# EAGLE design GBC USB-C Charging Kit Pro (EAGLE 6.2)
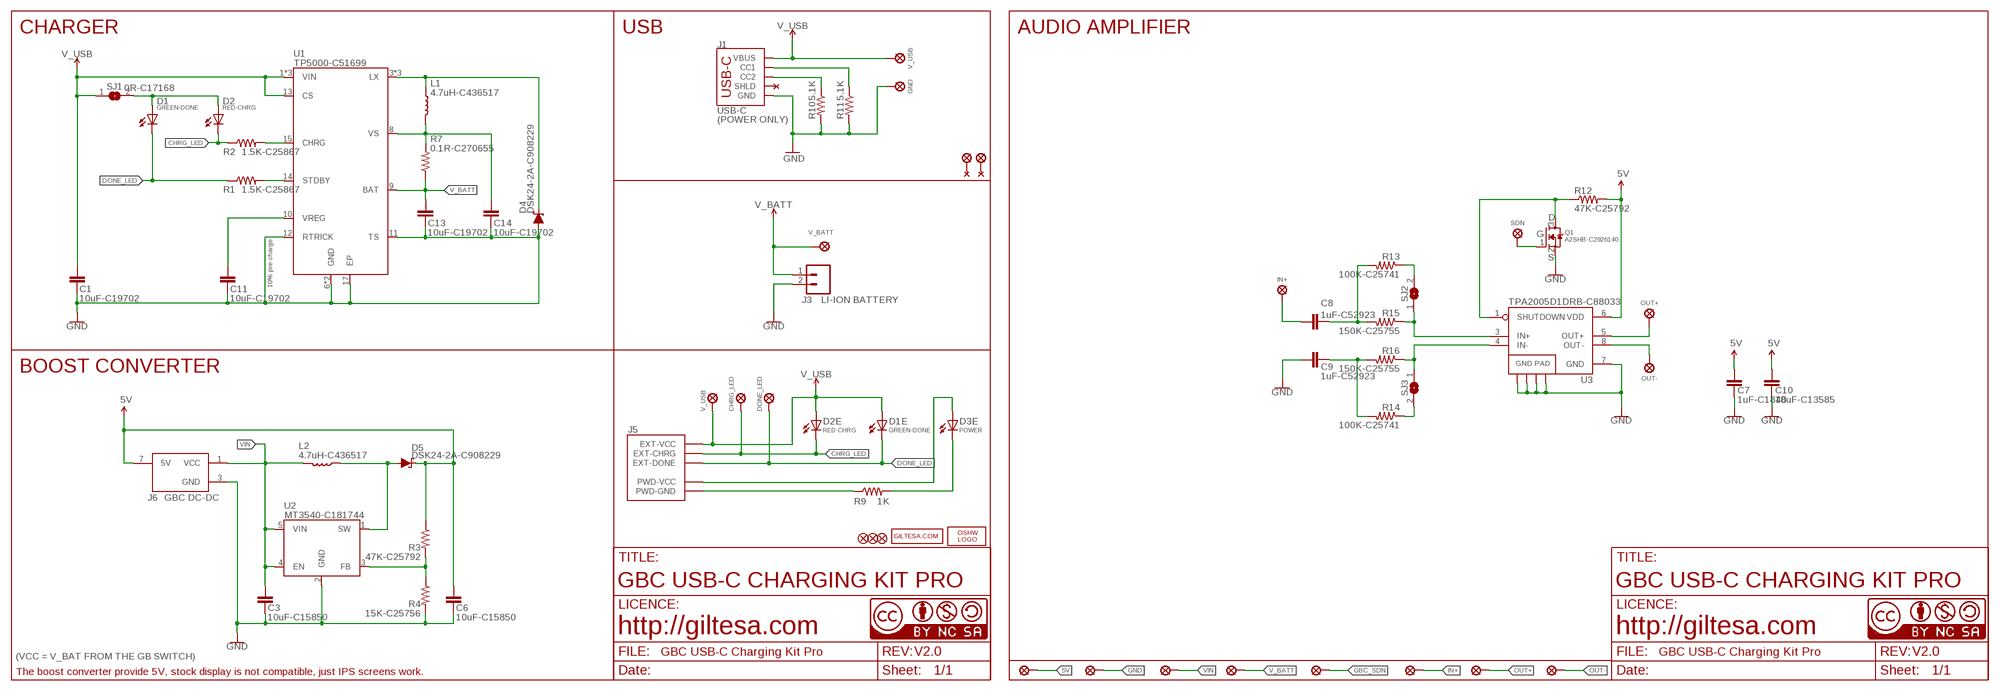
[diagram p0: schematic, sheet 1]

## Parts
C1  10uF-C19702  C0603_SMALL  [C0603_S]
C3  10uF-C15850  C0805_SMALL  [C0805_S]
C6  10uF-C15850  C0805_SMALL  [C0805_S]
C7  1uF-C1848  C1206  [C1206]
C8  1uF-C52923  C0603_SMALL  [C0603_S]
C9  1uF-C52923  C0603_SMALL  [C0603_S]
C10  10uF-C13585  C1206  [C1206]
C11  10uF-C19702  C0603_SMALL  [C0603_S]
C13  10uF-C19702  C0603_SMALL  [C0603_S]
C14  10uF-C19702  C0603_SMALL  [C0603_S]
D1  GREEN-DONE  L0402  [L0402]
D1E  GREEN-DONE  L0402  [L0402]
D2  RED-CHRG  L0402  [L0402]
D2E  RED-CHRG  L0402  [L0402]
D3E  POWER  L0402  [L0402]
D4  DSK24-2A-C908229  DIODE-SCHOTTKY_SOD-123FL  [SOD-123FL]
D5  DSK24-2A-C908229  DIODE-SCHOTTKY_SOD-123FL  [SOD-123FL]
FD2  FIDUCIALUFIDUCIAL  [FIDUCIAL-MICRO]
FD3  FIDUCIALUFIDUCIAL  [FIDUCIAL-MICRO]
FD4  FIDUCIALUFIDUCIAL  [FIDUCIAL-MICRO]
J1  USB-C  USB-CPOWER  [USB-C_6P]
J3  LI-ION BATTERY  JST-21MM  [JST-2-1MM-SMD_RIGHT]
J5  GBC_LED  [GBC_LED]
J6  GBC DC-DC  GBC_DC_DCDIP  [GBC_DC_DC_DIP]
L1  4.7uH-C436517  INDUCTOR_2  [PSPMAA0402]
L2  4.7uH-C436517  INDUCTOR_2  [PSPMAA0402]
LOGO2  OSHW_LOGO_FILLX0150-NT  [OSHW_FILLX150_NOTEXT]
PP1  SOLDER_PAD-1.5  [SOLDER_PAD_1.5]
PP2  SOLDER_PAD-1.5  [SOLDER_PAD_1.5]
PP3  SOLDER_PAD-1.5  [SOLDER_PAD_1.5]
PP4  SOLDER_PAD-1.5  [SOLDER_PAD_1.5]
PP5  SOLDER_PAD-1.5  [SOLDER_PAD_1.5]
PP6  SOLDER_PAD-1.5  [SOLDER_PAD_1.5]
PP7  SOLDER_PAD-1.5  [SOLDER_PAD_1.5]
PP8  SOLDER_PAD-1.5  [SOLDER_PAD_1.5]
Q1  A2SHB-C2926140  MOSFET-NCHANNEL_SMALL  [SOT23-3_S]
R1  1.5K-C25867  R0402  [R0402]
R2  1.5K-C25867  R0402  [R0402]
R3  47K-C25792  R0402  [R0402]
R4  15K-C25756  R0402  [R0402]
R7  0.1R-C270655  R0402  [R0402]
R9  1K  R0402  [R0402]
R10  5.1K  R0402  [R0402]
R11  5.1K  R0402  [R0402]
R12  47K-C25792  R0402  [R0402]
R13  100K-C25741  R0402  [R0402]
R14  100K-C25741  R0402  [R0402]
R15  150K-C25755  R0402  [R0402]
R16  150K-C25755  R0402  [R0402]
SJ1  0R-C17168  JUMPER-SMD0402  [JUMPER-SMD_0402]
SJ2  JUMPER-SMD0402  [JUMPER-SMD_0402]
SJ3  JUMPER-SMD0402  [JUMPER-SMD_0402]
U1  TP5000-C51699  TP5000  [QFN-16_4X4]
U2  MT3540-C181744  MT3540  [SOT-23-5]
U3  TPA2005D1DRB-C88033  TPA2005D1DRB  [QFN-8_PAD]
U$1  V_USB  SOLDER_PAD-1.5  [SOLDER_PAD_1.5]
U$2  SDN  PAD_1.0  [PAD_1.0]
U$3  GND  SOLDER_PAD-1.5  [SOLDER_PAD_1.5]
U$6  CC-BY-NC-SA15MM  [CC-BY-NC-SA_15MM]
U$9  SOLDER_PAD-2.5  [SOLDER_PAD_2.5]
U$16  GILTESA.COM_MASK  [GILTESA.COM_MASK]
U$17  CC-NC-BCNIX  [CC-NC-B_NIX]
U$20  OUT+  SOLDER_PAD-2.0  [SOLDER_PAD_2.0]
U$21  CC-NC-BCNIX  [CC-NC-B_NIX]
U$23  OUT-  SOLDER_PAD-2.0  [SOLDER_PAD_2.0]
U$24  CHRG_LED  SOLDER_PAD-1.3  [SOLDER_PAD_1.3]
U$25  DONE_LED  SOLDER_PAD-1.3  [SOLDER_PAD_1.3]
U$26  V_USB  SOLDER_PAD-1.3  [SOLDER_PAD_1.3]
U$29  V_BATT  PAD_1.25  [PAD_1.25]
U$30  IN+  SOLDER_PAD-1.3  [SOLDER_PAD_1.3]
U$32  SOLDER_PAD-2.5  [SOLDER_PAD_2.5]

## Nets
5V: C6.2 C7.2 C10.2 D5.C J6.7(5V) PP1.P$1 R3.1 R12.2 U3.6(VDD)
CHRG_LED: D2.C D2E.C J5.EXT-CHRG R2.1 U$24.P$1
DONE_LED: D1.C D1E.C J5.EXT-DONE R1.1 U$25.P$1
GBC_SDN: PP5.P$1 Q1.1(G) U$2.P$1
GND: C1.1 C3.1 C6.1 C7.1 C9.2 C10.1 C11.1 C13.1 C14.1 D4.A J1.GND1(GND) J1.GND2(GND) J3.2 J6.3(GND) PP2.P$1 Q1.2(S) R4.2 R10.2 R11.2 U1.6(GND) U1.7(GND) U1.11(TS) U1.12(RTRICK) U1.17(EP) U2.2(GND) U3.7(GND) U3.10(GND) U3.11(GND) U3.12(GND) U3.13(GND) U$3.P$1
IN+: C8.1 PP6.P$1 U$30.P$1
IN+AMP: R15.1 SJ2.1 U3.3(IN+)
IN-AMP: R16.1 SJ3.1 U3.4(IN-)
N$1: D1.A D2.A SJ1.2
N$2: R13.1 SJ2.2
N$3: D5.A L2.P$1 U2.1(SW)
N$4: J1.B5(CC2) R10.1
N$5: R14.1 SJ3.2
N$6: R2.2 U1.15(CHRG)
N$7: R3.2 R4.1 U2.3(FB)
N$8: J5.PWD-GND R9.1
N$10: D3E.A J5.PWD-VCC
N$11: D3E.C R9.2
N$13: J1.A5(CC1) R11.1
N$14: C8.2 R13.2 R15.2
N$15: C9.1 R14.2 R16.2
N$18: C11.2 U1.10(VREG)
N$19: R1.2 U1.14(STDBY)
N$20: C14.2 L1.P$2 R7.2 U1.8(VS)
N$21: D4.C L1.P$1 U1.3(LX) U1.4(LX) U1.5(LX)
OUT+: PP7.P$1 U3.5(OUT+) U$20.P$1
OUT-: PP8.P$1 U3.8(OUT-) U$23.P$1
SDN: Q1.3(D) R12.1 U3.1(SHUTDOWN)
V_BATT: C13.2 J3.1 PP4.P$1 R7.1 U1.9(BAT) U$29.P$1
V_USB: C1.2 D1E.A D2E.A J1.VBUS1(VBUS) J1.VBUS2(VBUS) J5.EXT-VCC SJ1.1 U1.1(VIN) U1.2(VIN) U1.13(CS) U1.16(VIN) U$1.P$1 U$26.P$1
VIN: C3.2 J6.1(VCC) L2.P$2 PP3.P$1 U2.4(EN) U2.5(VIN)
Unconnected: J1.SHLD1(SHLD) J1.SHLD2(SHLD) J1.SHLD3(SHLD) J1.SHLD4(SHLD) J1.SHLD5(SHLD) J1.SHLD6(SHLD) J1.SHLD7(SHLD) J1.SHLD8(SHLD) U$9.P$1 U$32.P$1

## Notes on the sheet
- CHARGER | USB | AUDIO AMPLIFIER
- (POWER ONLY)
- D
- G
- 10% pre-charge
- S
- BOOST CONVERTER
- GBC USB-C CHARGING KIT PRO | GBC USB-C CHARGING KIT PRO
- http://giltesa.com | http://giltesa.com
- (VCC = V_BAT FROM THE GB SWITCH) | V2.0 | V2.0
- The boost converter provide 5V, stock display is not compatible, just IPS screens work.

## Library data of the parts
C1 C8 C9 C11 C13 C14 = ,giltesa:C0603
C3 C6 = ,giltesa:C0805
C7 C10 = ,giltesa:C1206
D1 D1E D2 D2E D3E = ,giltesa:L0402
D4 D5 = ,giltesa:DIODE-SCHOTTKY
FD2-FD4 = SparkFun-Aesthetics:FIDUCIAL: Fiducial Alignment Points Point-of-reference for pick-and-place machines and other optical instruments.
J1 = ,giltesa:USB-C
J3 = ,giltesa:JST-2
J5 = ,giltesa:GBC_LED
J6 = ,giltesa:GBC_DC_DC
L1 L2 = ,giltesa:INDUCTOR
LOGO2 = ohw-logo:OSHW_LOGO_FILL
PP1-PP8 U$1 U$3 U$9 U$20 U$23-U$26 U$30 U$32 = ,giltesa:SOLDER_PAD
Q1 = ,giltesa:MOSFET-NCHANNEL
R1-R4 R7 R9-R16 = ,giltesa:R0402
SJ1-SJ3 = ,giltesa:JUMPER-SMD
U1 = ,giltesa:TP5000
U2 = ,giltesa:MT3540
U3 = mike-temp:TPA2005D1: 1.4W MONO CLASS-D AUDIO POWER AMPLIFIER The TPA2005D1 is a 1.4-W high efficiency filter-free class-D audio power amplifier in a BGA, QFN, or MSOP package that requires only three external components. Datasheet: http://focus.ti.com/lit/ds/symlink/tpa2005d1.pdf 1.4 W Into 8 ? From a 5V Supply at THD = 10% (Typ) Maximum Battery Life and Minimum Heat Efficiency With an 8-? Speaker: 84% at 400 mW, 79% at 100 mW 2.8-mA Quiescent Current 0.5-mA Shutdown Current Ideal for Wireless or Cellular Handsets and PDAs Capable of Driving an 8-? Speaker (2.5 V ? VDD ? 5.5 V) and a 4-? Speaker (2.5 V ? VDD ? 4.2 V) Only Three External Components Optimized PWM Output Stage Eliminates LC Output Filter Internally Generated 250-kHz Switching Frequency Eliminates Capacitor and Resistor Improved PSRR (-71 dB at 217 Hz) and Wide Supply Voltage (2.5 V to 5.5 V) Eliminates Need for a Voltage Regulator Fully Differential Design Reduces RF Rectification and Eliminates Bypass Capacitor Improved CMRR Eliminates Two Input Coupling Capacitors
U$2 U$29 = ,giltesa:PAD
U$6 = ,giltesa_logos:CC-BY-NC-SA
U$16 = ,giltesa_logos:GILTESA.COM
U$17 U$21 = cc-by-nc-sa:CC-NC-BC: All hardware is licensed under the Creative Commons Attribution-Noncommercial-Share Alike 2.5 Switzerland License. To view a copy of this license, visit http://creativecommons.org/licenses/by-nc-sa/2.5/ch/ or send a letter to Creative Commons, 171 Second Street, Suite 300, San Francisco, California, 94105, USA.

## Net classes
1 power: width 0.61 mm, drill 0.406 mm, clearance 0.203 mm
2 gnd: width 0.305 mm, drill 0.406 mm, clearance 0.203 mm
3 power usb: width 0.508 mm, drill 0.406 mm, clearance 0.203 mm

## Board
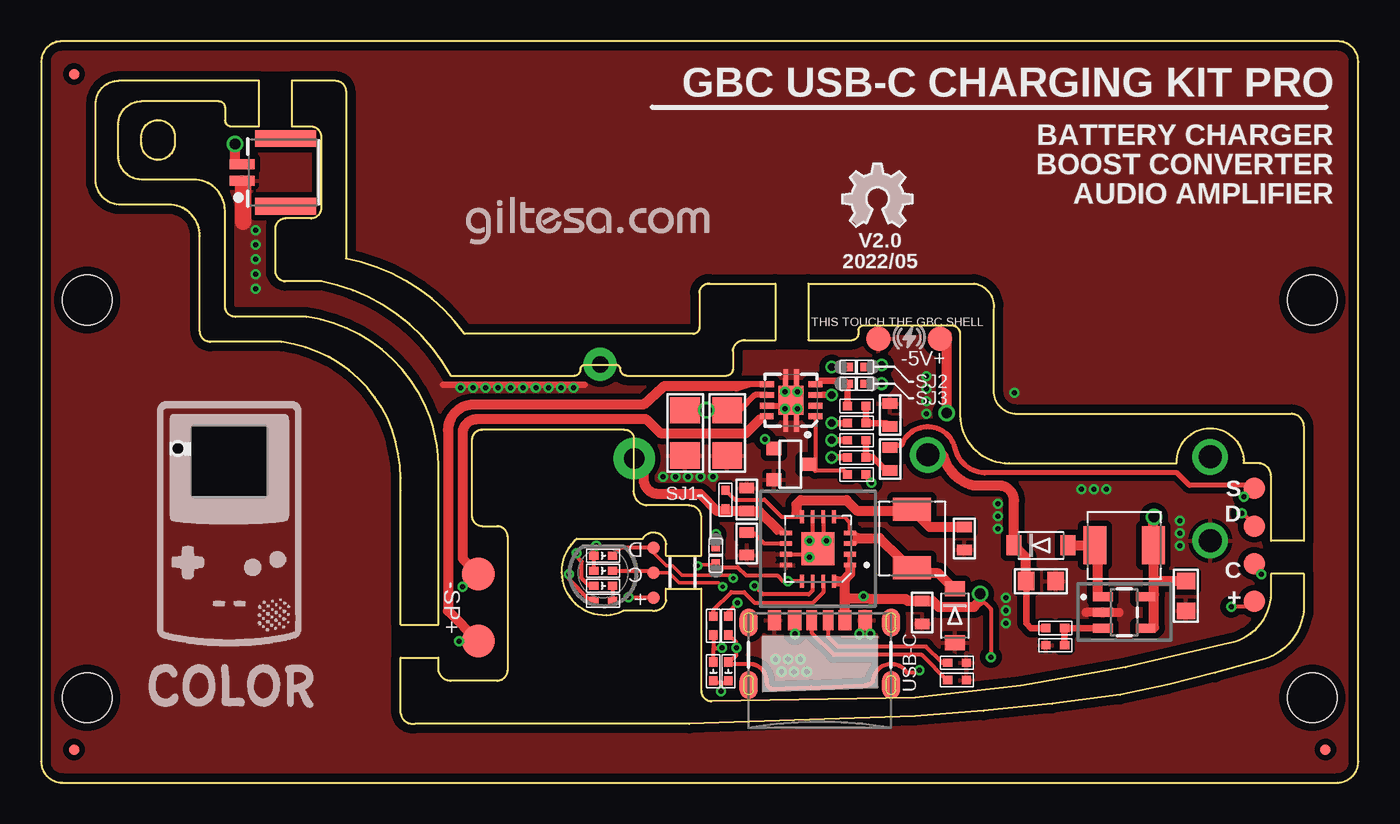
[diagram p1: board, top side]
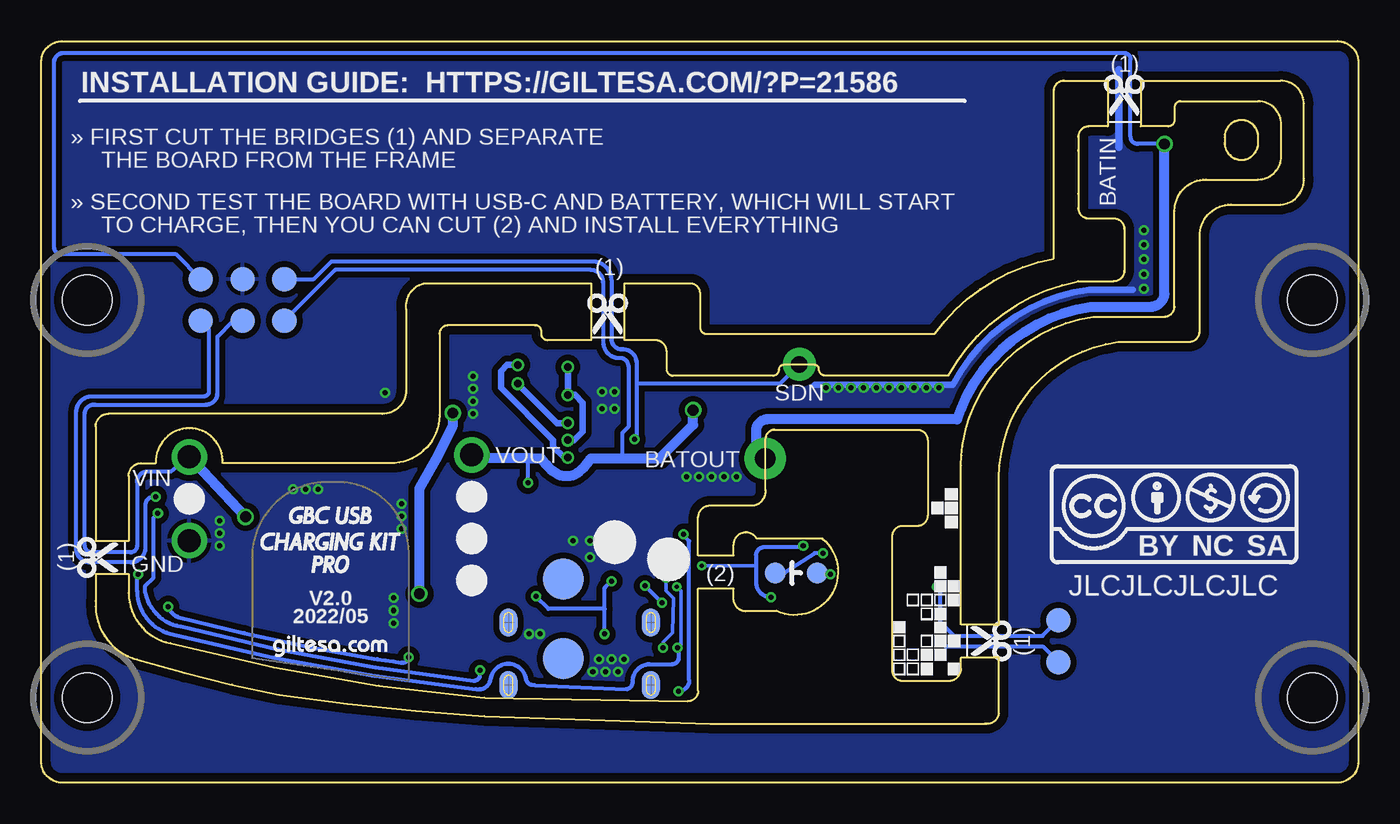
[diagram p2: board, bottom side, seen from below]

Size 79.97 x 45 mm. Coordinates in mm from the lower left corner, seen from the top.
Outline: 17,38.34 17,39.2 arc90 16.37,39.83 15.21,39.83 15.21,42.6 17.87,42.6 arc-90 18.5,41.98 18.5,31.81 arc-44 25.71,27.23 39.58,27.23 arc90 39.97,27.62 39.97,29.75 arc-90 40.6,30.29 44.58,30.29 44.58,26.86 42.76,26.86 arc90 42,26.19 42,25.08 arc-90 41.62,24.7 35.55,24.7 arc-90 35.16,25.1 arc90 34.91,25.35 33.01,25.35 arc90 32.75,25.1 arc-90 32.37,24.7 24.88,24.7 arc50 17,30.43 14.84,30.43 arc-90 14.21,31.07 14.21,33.61 arc-90 14.84,34.24 16.37,34.24 arc90 17,34.88 17,35.74
Outline: 17,38.39 17,35.76
Outline: 40.08,5.58 40.08,11.77 37.93,11.77 37.93,11.09 arc-90 37.13,10.42 35.33,10.42 arc-165 32.53,14.82 36.53,14.82 arc-149 37.93,14.44 37.93,13.77 40.08,13.77 40.08,16.12 arc90 39.31,16.82 36.78,16.82 arc-90 35.98,17.75 35.98,20.91 arc90 35.42,21.42 26.78,21.42 arc90 26.15,20.78 26.15,16.21 arc90 26.78,15.57 27.67,15.57 arc-90 28.31,14.94 28.31,6.81 arc-90 27.67,6.18 24.88,6.18 arc-90 24.11,6.94 24.11,7.59 21.83,7.59 21.83,4.2 arc90 22.69,3.57 39.34,3.57 53.06,4.04 arc5 65.51,5.32 arc5 74.12,7.46 arc80 76.66,11.01 76.66,12.67 74.66,12.67 74.66,11.51 arc-80 72.12,8.46 arc-10 53.06,5.16 40.72,4.94 arc-90 40.08,5.58
Outline: 50,27.75 55.28,27.75 arc-90 55.79,27.24 55.79,22.3 arc90 58.76,19.38 68.95,19.38 arc-185 73.01,19.38 73.9,19.38 arc-90 74.66,18.62 74.66,14.67 76.66,14.67 76.66,21.62 arc90 75.9,22.38 59.24,22.38 arc-90 57.82,23.78 57.82,28.73 arc90 56.65,30.29 46.58,30.29 46.58,26.86 49.24,26.86 arc90 49.62,27.24 49.62,27.46 arc-90 50,27.75
Outline: 1.27,0 78.7,0 arc90 79.97,1.27 79.97,43.73 arc90 78.7,45 1.27,45 arc90 0,43.73 0,1.27 arc90 1.27,0
Outline: 23.61,22.18 arc62 16.11,28.27 11.8,28.27 arc-90 11.16,28.91 11.16,34.7 arc90 9.26,36.6 6.08,36.6 arc-90 4.68,38 4.68,39.96 arc-90 6.08,41.35 10.78,41.35 arc-90 11.16,40.97 11.16,40.21 arc90 11.54,39.83 13.21,39.83 13.21,42.6 4.71,42.6 arc90 3.31,41.2 3.31,36.68 arc90 4.71,35.08 7.73,35.08 arc-90 9.64,33.18 9.64,27.39 arc90 10.27,26.75 14.59,26.75 arc-62 21.32,21.42 arc-20 21.83,17.73 21.83,9.59 24.11,9.59 24.11,19.26 arc20 23.61,22.18
Outline: 6.08,39.2 arc-180 8.11,39.2 8.11,38.81 arc-180 6.08,38.81 6.08,39.2
Copper layers (1*16): Top 0.035mm / dielectric 1.6mm / Bottom 0.035mm
Design rules: minimum track width 6mil, minimum drill 12mil, track to track 6mil, track to pad 6mil, pad to pad 6mil, via to via 8mil, smd to smd 0mil, copper to edge 20mil, drill to drill 10mil, minimum pad ring 6mil, minimum via ring 6mil, stop-mask expansion 0mil, vias tented up to drill 100mil, thermal gap 10mil
Holes 3 mm at 77.17,29.29 2.8,29.29 2.8,5.16 77.17,5.16
tRestrict: area 74.6,12.4 to 74.7,14.9; area 21.6,7.2 to 21.7,9.7; area 76.7,12.4 to 76.9,14.9; area 9.4,17.6 to 13.4,21.4; area 12.9,42.7 to 15.5,42.8; area 44.3,30.4 to 46.8,30.5; area 44.2,26.6 to 46.7,26.8; area 8.4,20.3 to 8.4,20.3; 2 lines
bRestrict: area 74.6,12.4 to 74.7,14.9; area 21.6,7.2 to 21.7,9.7; area 76.7,12.4 to 76.9,14.9; area 44.3,30.4 to 46.8,30.5; area 44.2,26.6 to 46.7,26.8; 1 lines

### Footprints (pad centres in the part's own frame; a part is rotated, then mirrored left to right if it is on the bottom)
C0603_S = smd 0.635 x 0.9: 1 -0.694,0; 2 0.694,0
C0805_S = smd 1 x 1.1: 1 -0.901,0; 2 0.901,0
C1206 = smd 1.6 x 1.8: 1 -1.362,0; 2 1.387,0
L0402 = smd 0.559 x 0.5: A -0.567,0; C 0.567,0
SOD-123FL = smd 0.91 x 1.22: A -1.637,0; C 1.637,0
FIDUCIAL-MICRO = smd 0.635 x 0.635: 1 0,0
USB-C_6P = smd 0.635 x 1.2: A5 -0.5,-0.017; B5 0.5,-0.017 | smd 0.8 x 1.2: GND1 -2.75,-0.017; GND2 2.75,-0.017; VBUS1 -1.52,-0.017; VBUS2 1.52,-0.017 | smd 1.1 x 1.7: SHLD1 -4.32,-0.15; SHLD2 4.32,-0.15; SHLD5 -4.32,-3.95; SHLD8 4.32,-3.95 | smd 1.1 x 1.7 bottom: SHLD3 -4.32,-0.15; SHLD4 4.32,-0.15; SHLD6 -4.32,-3.95; SHLD7 4.32,-3.95
JST-2-1MM-SMD_RIGHT = smd 0.6 x 1.524: 1 -0.5,-2.017; 2 0.5,-2.017 | smd 1.016 x 3.683: NC1 -2.054,0.635; NC2 2.054,0.635
GBC_LED = smd 0.762 x 0.762: EXT-CHRG -3.048,0; EXT-DONE -3.048,-1.524; EXT-VCC -3.048,1.524 | smd 1.27 x 1.27 bottom: PWD-GND 1.27,0; PWD-VCC -1.27,0
GBC_DC_DC_DIP = drill 1.397 pad 2.159: 1 17.145,7.493; 3 17.145,2.413; 7 0,7.62
PSPMAA0402 = smd 1.4 x 2.3: P$1 -1.775,0; P$2 1.775,0
SOLDER_PAD_1.5 = smd 1.5 x 1.5: P$1 0,0
SOT23-3_S = smd 0.8 x 0.9: 1 -0.95,-1; 2 0.95,-1; 3 0,1.1
R0402 = smd 0.559 x 0.5: 1 -0.567,0; 2 0.567,0
JUMPER-SMD_0402 = smd 0.635 x 0.5: 1 -0.559,0; 2 0.559,0
QFN-16_4X4 = smd 0.81 x 0.3: 1 -1.95,0.975; 2 -1.95,0.325; 3 -1.95,-0.325; 4 -1.95,-0.975; 9 1.95,-0.975; 10 1.95,-0.325; 11 1.95,0.325; 12 1.95,0.975 | smd 0.3 x 0.81: 5 -0.975,-1.95; 6 -0.325,-1.95; 7 0.325,-1.95; 8 0.975,-1.95; 13 0.975,1.95; 14 0.325,1.95; 15 -0.325,1.95; 16 -0.975,1.95 | smd 2 x 2: 17 0,0
SOT-23-5 = smd 0.55 x 1.2: 1 -0.95,-1.3; 2 0,-1.3; 3 0.95,-1.3; 4 0.95,1.3; 5 -0.95,1.3
QFN-8_PAD = smd 0.35 x 0.85: 1 -0.975,-1.475; 2 -0.325,-1.475; 3 0.325,-1.475; 4 0.975,-1.475; 5 0.975,1.475; 6 0.325,1.475; 7 -0.325,1.475; 8 -0.975,1.475 | smd 1.75 x 1.5: 9 0,0 | smd 1.025 x 0.28: 10 -1.387,-0.325; 11 1.387,-0.325; 12 1.387,0.325; 13 -1.387,0.325
PAD_1.0 = drill 1 pad 2: P$1 0,0
SOLDER_PAD_2.5 = smd 2.5 x 2.5: P$1 0,0
SOLDER_PAD_2.0 = smd 2 x 2: P$1 0,0
SOLDER_PAD_1.3 = smd 1.3 x 1.3: P$1 0,0
PAD_1.25 = drill 1.25 pad 2.5: P$1 0,0

### Placement (x,y rotation side)
C1  53.49,10.33 90 top
C3  69.51,11.33 90 top
C6  60.71,12.24 180 top
C7  39.09,21.21 90 top
C8  51.54,19.65 270 top
C9  51.54,22.31 90 top
C10  41.65,21.21 90 top
C11  42.84,14.5 90 top
C13  42.84,17.18 270 top
C14  56.05,14.82 90 top
D1  41.72,6.75 90 top
D1E  34.12,13.77 0 top
D2  40.81,6.75 90 top
D2E  34.12,12.86 0 top
D3E  34.12,11.95 0 top
D4  55.48,10.14 90 top
D5  60.71,14.4 180 top
FD2  2,43 0 top
FD3  77.97,2 0 top
FD4  2,2 0 top
J1  47.28,9.87 0 top
J3  14.21,37.04 270 top
J5  34.12,12.73 180 top
J6  53.83,12.27 0 top
L1  52.88,14.82 90 top
L2  65.76,14.4 0 top
LOGO2  48.65,33.75 0 top
PP1  65.2,28.02 0 bottom
PP2  67.75,30.56 0 bottom
PP3  67.75,28.02 0 bottom
PP4  70.28,30.56 0 bottom
PP5  65.2,30.56 0 bottom
PP6  70.28,28.02 0 bottom
PP7  18.21,7.32 0 bottom
PP8  18.21,9.86 0 bottom
Q1  45.48,19.33 270 top
R1  41.72,9.53 90 top
R2  40.81,9.53 90 top
R3  61.57,9.38 0 top
R4  61.57,8.34 180 top
R7  41.55,17.18 90 top
R9  34.12,11.03 0 top
R10  55.61,7.27 0 top
R11  55.61,6.23 0 top
R12  49.52,18.7 0 top
R13  49.52,19.74 0 top
R14  49.52,21.82 0 top
R15  49.52,20.78 0 top
R16  49.52,22.86 0 top
SJ1  40.96,13.79 90 top
SJ2  49.52,25.23 0 top
SJ3  49.52,24.21 0 top
U1  47.16,14.18 180 top
U2  65.76,10.33 270 top
U3  45.53,23.2 90 top
U$1  54.58,26.93 180 top
U$2  33.94,25.38 0 top
U$3  50.83,26.93 180 top
U$6  18.74,13.24 0 bottom
U$7  [GAME_BOY_COLOR_1.2]  6.52,4.55 0 top
U$8  [SCISSOR]  45.57,27.19 90 bottom
U$9  48.27,12.35 0 bottom
U$10  [TETRIS]  24.05,6.43 0 top
U$13  [SCISSOR]  14.2,40.46 90 bottom
U$14  [SCISSOR]  23.55,8.6 0 bottom
U$15  [SCISSOR]  75.29,13.67 180 bottom
U$16  25.7,32.59 0 top
U$17  0,0 0 top
U$19  [QI]  52.7,27.03 180 top
U$20  26.53,8.59 0 top
U$21  0,0 0 top
U$23  26.53,12.65 0 top
U$24  73.64,13.29 0 top
U$25  73.64,15.57 0 top
U$26  73.64,11 0 top
U$28  [GAME_BOY_COLOR_2]  7.02,8.21 0 top
U$29  36.01,19.67 0 top
U$30  73.64,17.86 0 top
U$32  48.27,7.52 0 bottom
U$33  [GILTESA.COM_MASK_7MM]  65.9,7.57 0 bottom
U$34  [GAME_BOY_COLOR_USB_CHARGING_KIT_PRO]  66.66,12.65 0 bottom

### Tracks (layer width: path | path; a pad name or v marks a point on that pad's centre or on a via)
5V  (via drill 0.3, 0.66)
  Top 0.254: R12.2 50.08,18.53 v50.42,18.19
  Top 0.356: U3.6 43.34,23.53 42.42,22.61 41.53,22.61 C10.2
  Top 0.406: R3.1 60.09,9.38 59.8,9.66 C6.2
  Top 0.61: C6.2 59.77,12.24 59.77,13.69 D5.C 59.07,17.13 arc90 59.05,17.14 arc90 58.17,18.03 56.59,18.03 arc-60 54.74,19.89 J6.7 | C7.2 40.38,22.6 v40.39,22.61 41.53,22.61
  Bottom 0.254: 65.01,28.08 65.01,28.02 PP1.P$1 62.11,31.11 46.61,31.11 arc90 45.85,30.35 45.85,26.67 arc-90 44.83,25.78 arc90 44.32,25.27 44.32,21.59 44.7,21.21 44.7,19.68 | v50.42,18.19 50.42,19.77 50.29,19.68
  Bottom 0.61: v40.39,22.61 40.39,21.72 42.42,19.68 44.7,19.68 46.61,19.68 arc30 47.62,18.67 arc30 48.51,18.67 arc30 49.61,19.68 50.29,19.68 53.63,19.68 J6.7
CHRG_LED  (via drill 0.25, 0.3)
  Top 0.203: v41.39,11.89 41.13,12.14 38.72,12.14 38.13,12.73 J5.EXT-CHRG 37.24,12.73
  Top 0.254: D2.C 40.83,8.16 | 40.83,8.16 41.3,8.16 v41.32,8.18 | D2E.C 37.04,12.86 J5.EXT-CHRG | U$24.P$1 v74.09,12.65 | R2.1 40.83,8.16
  Bottom 0.203: v41.39,11.89 41.13,11.64 41.13,8.37 v41.32,8.18
  Bottom 0.254: v74.09,12.65 74.15,12.59 74.15,11.64 arc-80 71.87,8.97 arc-8 53.58,5.67 53.33,5.67 arc-80 52.69,6.3 arc160 50.53,6.3 arc-80 50.15,5.92 50.02,5.92 44.44,5.67 arc-85 44.05,6.18 arc87 43.04,7.19 41.64,7.19 arc-90 41.26,7.57 41.26,8.12 v41.32,8.18
DONE_LED  (via drill 0.25, 0.3)
  Top 0.203: v42.02,12.4 41.84,12.58 38.92,12.58 38.34,13.16 37.96,13.16 37.17,13.95 J5.EXT-DONE
  Top 0.254: J5.EXT-DONE 35.18,14.26 D1E.C | 73.64,15.45 U$25.P$1 73.64,15.7 v72.88,16.34 | v53.33,6.81 53.2,6.68 52.56,6.68 arc138 50.53,6.3 arc-90 50.02,5.92 46.72,5.77 44.44,5.67 arc-90 44.05,6.18 arc88 43.04,7.19 41.83,7.19 D1.C 42.21,7.73 v42.21,8.18 42.21,8.53 R1.1
  Bottom 0.203: v42.21,8.18 42.21,8.53 41.64,9.1 41.58,11.19 42.02,11.64 v42.02,12.4
  Bottom 0.254: 53.33,6.68 v53.33,6.81 53.33,6.56 arc90 53.71,6.18 arc8 71.49,9.48 arc70 73.64,11.51 73.64,11.95 73.15,12.45 73.15,16.07 v72.88,16.34
GBC_SDN  (via drill 0.3)
  Top 0.254: Q1.1 v43.94,20.83
  Bottom 0.254: U$2.P$1 35.11,24.21 43.73,24.21 43.81,24.13 | PP5.P$1 63.42,30.56 62.36,31.62 46.48,31.62 arc90 45.34,30.48 45.34,26.92 arc-90 44.7,26.29 arc90 43.81,25.53 43.81,24.13 | 43.81,24.13 43.81,20.95 v43.94,20.83
GND  (via drill 0.3)
  Top 0.254: v45.15,23.71 45.15,24.54 U3.12 | U3.13 45.2,22.64 v45.15,22.7 | U1.11 46.84,13.86 | U1.6 47.49,14.73 | 47.49,14.73 47.49,14.61 | v47.67,14.69 47.53,14.69 47.49,14.73 | U1.7 46.84,14.51 U1.17
  Top 0.356: U3.7 44.97,22.88 v45.15,22.7
  Top 0.406: 24.39,24.13 32.98,24.13 | 46.84,13.86 47.49,13.86 47.49,14.51 | 47.49,14.51 47.49,14.61 | 47.49,14.51 47.16,14.51 U1.17
  Top 0.559: 63.45,10.33 U2.2 65.45,10.33
  Top 1.016: 12.25,34.04 12.25,36.22
  Bottom 0.406: 32.98,24.13 24.62,24.13 arc55 16.32,29.93 13.7,29.93
  Bottom 0.457: 14.54,43.26 14.54,38.56
  other vias: 25.46,23.96 26.22,23.96 26.99,23.96 27.75,23.96 28.51,23.96 29.27,23.96 30.03,23.96 30.8,23.96 31.56,23.96 32.32,23.96 13.02,33.53 13.02,32.64 13.02,31.75 13.02,30.86 13.02,29.98 45.91,22.7 45.91,23.71 44.57,7.5 45.34,7.5 46.1,7.5 59.09,23.65 44.96,6.73 45.72,6.73 46.48,6.73 49.69,9.02 50.35,9.02 46.66,14.69 46.66,13.67 53.76,24.67 53.76,23.91 53.76,23.15 53.76,22.38 37.76,18.57 38.52,18.57 39.28,18.57 40.04,18.57 40.8,18.57 58.08,16.92 58.08,16.16 58.08,15.4 63.16,17.81 63.92,17.81 64.68,17.81 58.58,11.21 58.58,10.45 58.58,9.68 69.12,15.91 69.12,15.14 69.12,14.38
  pour Top (isolate 0.356): -2,47 81.97,47 81.97,-2 -2,-2
  pour Bottom (isolate 0.356): -2,47 81.97,47 81.97,-2 -2,-2
IN+  (via drill 0.3)
  Top 0.254: v73.01,17.35 73.52,17.86 U$30.P$1 73.34,18.16 | 51.69,20.45 51.58,20.34 C8.1
  Top 0.305: 73.34,18.16 73.34,18.1 73.41,18.03 69.72,18.03 68.96,18.8 57.28,18.8 arc-75 55.49,20.32 arc146 52.22,20.45 51.54,20.45 C8.1
  Top 0.406: 73.64,17.99 U$30.P$1
  Bottom 0.254: v73.01,17.35 73.14,17.35 arc-90 73.64,16.84 73.64,14.26 arc90 74.53,13.37 76.95,13.37 arc90 77.84,14.13 77.84,22.56 arc90 76.82,23.45 70.09,23.45 arc-90 69.78,23.76 69.78,27.51 PP6.P$1
IN+AMP  (via drill 0.46)
  Top 0.305: U3.3 47.46,23.53
  Top 0.381: 47.46,23.53 v47.99,23.53
  Top 0.406: R15.1 v47.99,20.78 | SJ2.1 v47.99,25.23
  Bottom 0.406: v47.99,25.23 v47.99,23.53 47.56,23.53 47.1,23.07 47.1,21.29 47.61,20.78 v47.99,20.78
IN-AMP
  Top 0.305: 47.21,24.38 U3.4
  Top 0.381: 48.95,24.22 SJ3.1 | R16.1 48.96,22.81
  Top 0.406: 48.96,22.81 SJ3.1 | 48.95,24.22 48.93,24.22 48.77,24.38 47.21,24.38
N$1  (via drill 0.3)
  Top 0.254: 41.28,6.07 v41.28,5.55 | SJ1.2 v40.96,15.07 | 41.28,6.07 41.72,6.07 D1.A | 41.28,6.07 40.83,6.07 D2.A
  Bottom 0.254: v41.28,5.55 arc-90 40.62,6.2 40.62,14.66 v40.96,15.07
N$2  (via drill 0.46)
  Top 0.406: R13.1 v47.99,19.74 | SJ2.2 50.91,25.23 v51.04,25.35
  Bottom 0.406: v51.04,25.35 51.67,25.35 52.05,24.97 52.05,23.96 48.88,20.78 48.88,20.4 48.22,19.74 v47.99,19.74
N$3
  Top 0.508: U2.1 64.28,11.28 64.16,11.43
  Top 0.61: D5.A L2.P$1 64.16,14.24 64.16,11.43
N$4
  Top 0.254: J1.B5 47.78,8.87 48.39,8.26 53.72,8.26 54.71,7.27 R10.1
N$5  (via drill 0.46)
  Top 0.406: R14.1 v47.99,21.82 | SJ3.2 v51.04,24.21
  Bottom 0.406: v47.99,21.82 48.65,21.82 v51.04,24.21
N$6
  Top 0.254: 47.5,11.97 U1.15 47.49,11.55 46.86,10.92 43.31,10.92 42.67,11.56 41.91,11.56 40.83,10.48 R2.2
N$7
  Top 0.406: U2.3 R3.2 R4.1
N$8  (via drill 0.3)
  Top 0.254: R9.1 33.31,11.08 32.05,12.34 v32.05,12.65
  Bottom 0.254: J5.PWD-GND 32.07,12.73 v32.05,12.65
N$10  (via drill 0.3)
  Top 0.254: D3E.A 33.24,11.97 32.81,12.4 32.81,13.41 32.5,13.73 v32.5,13.92
  Bottom 0.254: v32.5,13.92 33.01,13.92 34.83,12.73 J5.PWD-VCC
N$11
  Top 0.254: D3E.C R9.2
N$13
  Top 0.254: J1.A5 46.78,9.1 48.13,7.75 53.47,7.75 54.99,6.23 R11.1
N$14
  Top 0.406: R15.2 R13.2 50.49,19.74 51.28,18.95 C8.2
N$15
  Top 0.254: 51.33,21.82 C9.1
  Top 0.381: R14.2 51.33,21.82
  Top 0.406: R16.2 R14.2
N$18
  Top 0.254: U1.10 43.91,14.51 43.23,15.19 C11.2
N$19  (via drill 0.3)
  Top 0.254: U1.14 46.84,11.66 46.61,11.43 43.81,11.43 v43.31,11.94 | R1.2 41.72,10.35 v42.29,10.92
  Bottom 0.254: v43.31,11.94 v42.29,10.92
N$20
  Top 0.254: 41.56,17.75 R7.2 42.11,17.18 43.91,17.18 44.96,16.13 U1.8 45.99,16.33 45.85,16.33
  Top 0.61: 45.85,16.33 45.85,16.89 46.1,17.14 48.9,17.14 49.53,16.51 52.8,16.51 L1.P$2 53.96,15.51 C14.2
N$21
  Top 0.254: U1.3 49.41,14.51 49.73,14.83 49.41,15.16 U1.4 49.11,15.78 48.77,16.13 U1.5 | 49.38,14.68 49.38,15.09 49.58,14.88 49.58,14.83 49.38,14.68 | 49.38,14.53 49.38,14.68
  Top 0.305: 49.73,14.83 49.58,14.83
  Top 0.61: 49.58,14.83 50.91,14.83 52.2,13.55 52.2,13.08 52.24,13.04 L1.P$1 53.22,12.7 54.48,12.7 55.23,11.96 D4.C
OUT+  (via drill 0.3)
  Top 0.152: 42.22,24.05 42.16,23.85 42.24,23.82 43.1,24.08 42.44,23.98
  Top 0.254: v25.39,8.59 U$20.P$1
  Top 0.356: U3.5 42.24,24.18 42.22,24.05
  Top 0.61: U$20.P$1 24.7,10.42 24.7,21.42 arc-90 26.27,22.94 36.56,22.94 37.7,23.96 37.8,24.05 42.22,24.05
  Bottom 0.254: 18.21,7.39 PP7.P$1 19.17,8.27 25.07,8.27 v25.39,8.59
OUT-  (via drill 0.3)
  Top 0.254: v25.58,11.89 26.4,12.65 U$23.P$1
  Top 0.305: 43.62,22.04 43.88,22.23 U3.8
  Top 0.61: U$23.P$1 25.59,13.6 25.59,21.16 arc-90 26.4,22.05 36.75,22.05 37.59,21.21 42.8,21.21 43.62,22.04
  Bottom 0.254: 18.21,9.54 PP8.P$1 19.17,8.9 24.56,8.9 25.39,9.73 25.39,11.64 v25.58,11.89
SDN
  Top 0.254: R12.1 48.95,18.74 48.77,18.92 46.99,18.92 | 46.99,18.92 Q1.3 | U3.1 47.01,18.94 46.99,18.92
V_BATT  (via drill 0.66)
  Top 0.254: U1.9 44.66,15.16 44.58,15.24 44.7,15.37 | 44.7,15.37 44.83,15.49 45.09,15.24 44.83,15.24 44.7,15.37
  Top 0.305: 41.05,16.48 41.42,16.48 R7.1
  Top 0.61: J3.1 11.73,37.54 11.77,37.6 v11.77,38.76 | U$29.P$1 36.08,19.67 36.58,19.18 36.58,18.41 arc90 37.47,17.53 40.01,17.53 41.05,16.48 C13.2 43.59,16.48 44.7,15.37
  Bottom 0.254: v11.77,38.76 13.39,38.76 arc90 13.83,39.2 13.83,43.9 arc-90 14.21,44.28 78.62,44.28 arc-90 79.2,43.7 79.2,32.53 arc-90 78.75,32.08 71.81,32.08 PP4.P$1
  Bottom 0.61: v11.77,38.76 11.77,29.67 arc90 12.69,28.88 16.24,28.88 arc-60 24.11,22.69 24.37,22.05 35.93,22.05 arc-80 36.56,21.42 36.56,20.23 U$29.P$1
V_USB  (via drill 0.25, 0.3, 0.66)
  Top 0.203: SJ1.1 39.94,13.23 v39.86,13.16
  Top 0.254: J5.EXT-VCC 35.72,11.21 v35.67,11.26 | D2E.A D1E.A 33.56,14.22 v33.7,14.37 | U1.16 48.3,12.23 | U1.1 49.11,12.99 | U1.13 v45.34,12.23 45.05,12.23 44.7,12.57 42.8,12.57 42.29,13.08 41.15,13.08 41.02,13.21 40.99,13.21 SJ1.1 | J1.VBUS1 v45.76,9.02 | v49.91,11.3 50.29,11.15 | U$26.P$1 73.61,11 73.28,10.67 v72.26,10.67 | v57.01,11.46 57.01,11.19 57.66,10.54 v57.66,7.62
  Top 0.305: U1.1 U1.2
  Top 0.61: U$1.P$1 54.98,27.18 v54.98,22.43 | 48.3,12.23 48.68,12.23 | 48.68,12.23 49.11,12.66 49.11,12.99 | J1.VBUS2 48.8,11.05 | 48.8,11.05 48.8,12.12 48.68,12.23 | 48.8,11.05 48.83,11.15 50.29,11.15 52.48,11.15 52.61,11.02 C1.2 54.13,11.02 54.48,10.67 56.64,10.67 57.01,11.03 v57.01,11.46
  Bottom 0.203: v39.86,13.16 36.56,13.16
  Bottom 0.254: 45.76,10.54 49.18,10.54 49.91,11.28 v49.91,11.3 | v45.76,9.02 45.76,10.54 | 45.76,10.54 45.76,11.81 v45.34,12.23 | v72.26,10.67 arc-50 71.63,10.03 arc-5 59.56,7.49 arc0 58.12,7.29 arc-104 v57.66,7.62 | v33.7,14.37 33.77,14.3 36.05,14.3 arc-90 36.56,13.8 36.56,13.16 36.56,12.14 arc-90 v35.67,11.26
  Bottom 0.61: v54.98,22.43 54.98,21.67 55.99,19.64 57.01,17.86 v57.01,11.46
VIN  (via drill 0.66)
  Top 0.508: U2.4 67.42,9.38 67.56,9.42 | U2.5 67.42,11.28 67.56,11.43
  Top 0.61: 67.56,9.42 67.56,11.43 67.56,12.19 | 67.56,12.19 67.56,14.36 L2.P$2 67.53,16.1 v67.56,16.13 | C3.2 67.6,12.23 67.56,12.19
  Bottom 0.254: PP3.P$1 68.31,28.02 69.27,27.06 69.27,23.63 arc90 69.96,22.94 76.69,22.94 arc-90 77.33,22.43 77.33,14.36 arc-90 76.85,13.98 74.56,13.98 arc-90 74.15,14.36 74.15,18.24 arc90 73.52,18.88 72.12,18.88 J6.1
  Bottom 0.61: v67.56,16.13 67.6,16.13 J6.1

### Text on the board
tPlace: GBC USB-C CHARGING KIT PRO | BATTERY CHARGER | BOOST CONVERTER | AUDIO AMPLIFIER | V2.0 | 2022/05 | THIS TOUCH THE GBC SHELL | -5V+ | S | D | D | C | C | -SP+ | + | +
bPlace: (1) | INSTALLATION GUIDE: HTTPS://GILTESA.COM/?P=21586 | » FIRST CUT THE BRIDGES (1) AND SEPARATE | THE BOARD FROM THE FRAME | BATIN | » SECOND TEST THE BOARD WITH USB-C AND BATTERY, WHICH WILL START | TO CHARGE, THEN YOU CAN CUT (2) AND INSTALL EVERYTHING | (1) | SDN | BATOUT | VOUT | VIN | (1) | (2) | GND | JLCJLCJLCJLC | V2.0 | 2022/05 | (1)
Measures: 0.0562248995983936
tDocu: U3 | U2